# Altium project CDF_sensor.PrjPcb
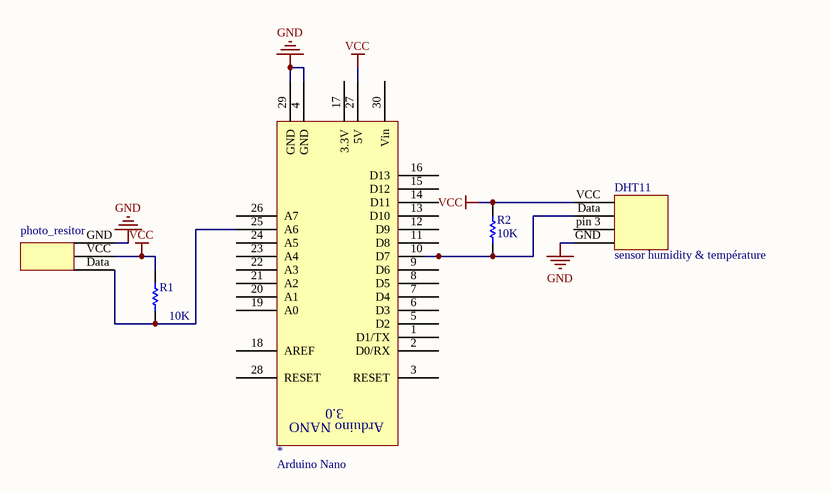
[diagram p0: shemat.SchDoc]
1 sheet, 5 parts. Net scope: global (net labels, ports and power ports of the same name join across sheets).
Board file: LPKF_ISEN_MAXSIZE_22-05-2017.PCBDOC

## Sheet shemat.SchDoc
size A4

### Parts
*  Arduino Nano  [Arduino Nano FootPrint]
DHT11  sensor humidity & température  [DHT11]
photo_resitor  (no value)  [photo_resitor]
R1  value 10K  [AXIAL-0.3]  (hidden comment: Res1)
R2  value 10K  [AXIAL-0.3]  (hidden comment: Res1)

### Nets
GND: *.4(GND) *.29(GND) DHT11.GND photo_resitor.GND(gnd)
VCC: *.27(5V) DHT11.VCC(vcc) photo_resitor.VCC(data) R1.1 R2.2
Net*_10: *.10(D7) DHT11.Data(data) R2.1
Net*_25: *.25(A6) photo_resitor.Data(data) R1.2

Not connected (* = marked no-connect by the designer): * 1(D1/TX) 2(D0/RX) 3(RESET) 5(D2) 6(D3) 7(D4) 8(D5) 9(D6) 11(D8) 12(D9) 13(D10) 14(D11) 15(D12) 16(D13) 17(3.3V) 18(AREF) 19(A0) 20(A1) 21(A2) 22(A3) 23(A4) 24(A5) 26(A7) 28(RESET) 30(Vin); DHT11 pin 3(4)

### Notes on the sheet
- (in symbol Arduino Nano) 3.0; Arduino NANO

### Library data of the parts
DHT11 = DHT11
photo_resitor = photo_resistor
R1 R2 = Res1: Resistor; Published: 8-Jun-2000; LatestRevisionDate: 17-Jul-2002; LatestRevisionNote: Re-released for DXP Platform.; PackageReference: AXIAL-0.3; Publisher: Altium Limited; PackageDescription: Axial Device, Thru-Hole; 2 Leads; 0.3 in Pin Spacing